# Altium schematic sheet PowerSupply.SchDoc: Power Supply Unit
size A; SheetNumber: 3; SheetTotal: 7
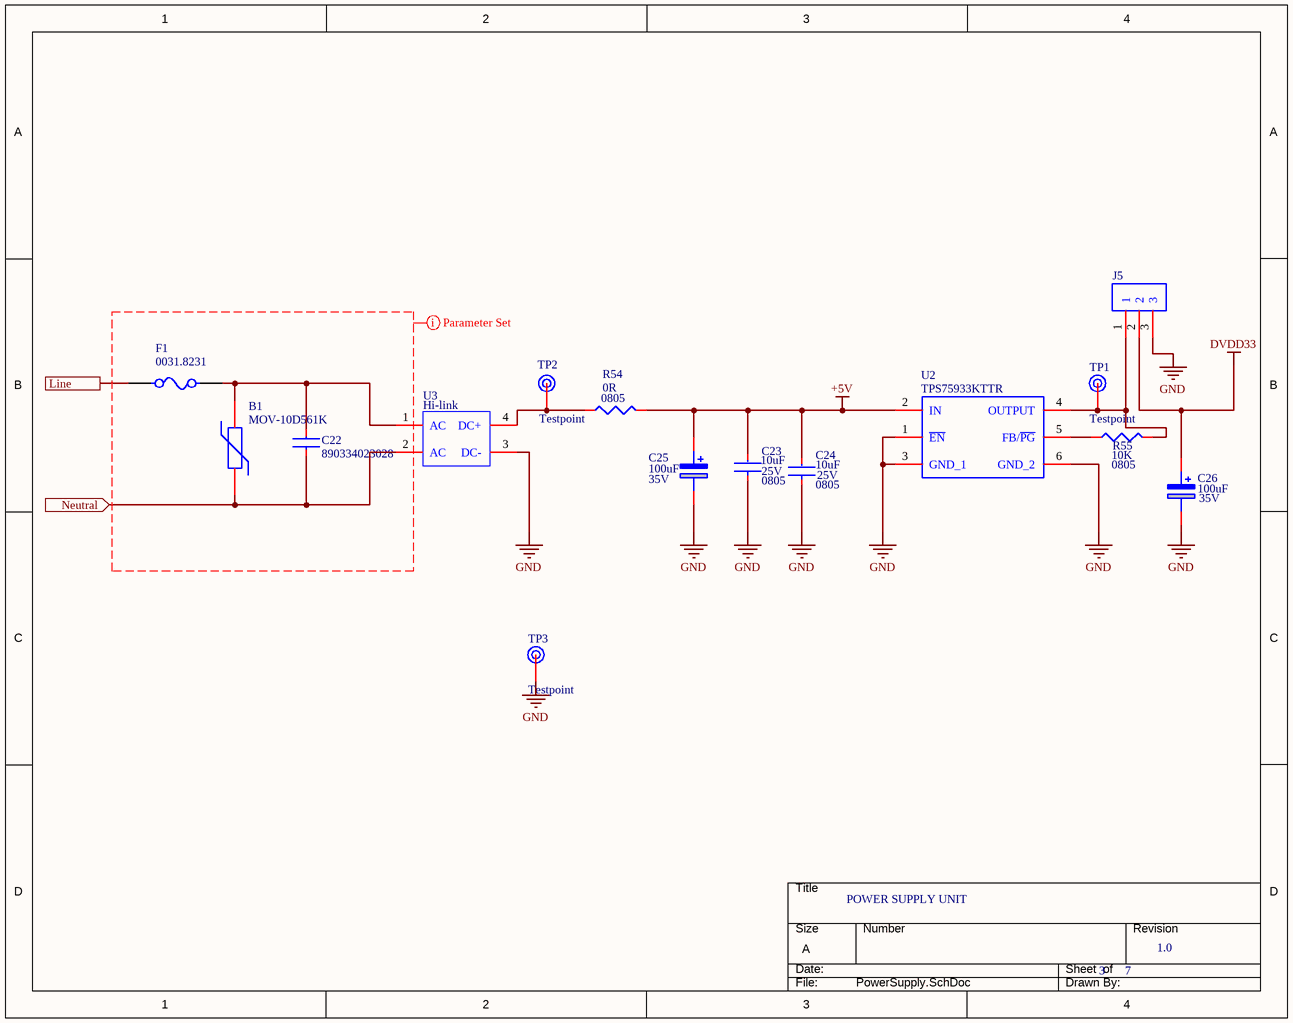
[diagram p0: PowerSupply.SchDoc]

## Parts
B1  MOV-10D561K  [MOV10D561K]
C22  890334023028  [890334023028]
C23  Capacitance: 10uF  Voltage: 25V  Size: 0805  [FP-GRM21B-0_2-e0_2_0_7-IPC_B]  (hidden comment: GRM21BC71E106KE01L)
C24  Capacitance: 10uF  Voltage: 25V  Size: 0805  [FP-GRM21B-0_2-e0_2_0_7-IPC_B]  (hidden comment: GRM21BC71E106KE01L)
C25  Capacitance: 100uF  Voltage: 35V  [CAPPRD250W50D630H1250]  (hidden comment: ESC107M035AE3AA)
C26  Capacitance: 100uF  Voltage: 35V  [CAPPRD250W50D630H1250]  (hidden comment: ESC107M035AE3AA)
F1  0031.8231  [FP-0031_8231-MFG]
J5  HTSW-103-07-G-S  [HDRV3W64P0X254_1X3_749X249X858P]  (value not drawn)
R54  Resistance: 0R  Size: 0805  [RESC2013X84N]  (hidden comment: WSL080500000ZEA9)
R55  Resistance: 10K  Size: 0805  [RESC2013X84N]  (hidden comment: CRCW201010K0JNEFIF)
TP1  Testpoint  [Testpad]
TP2  Testpoint  [Testpad]
TP3  Testpoint  [Testpad]
U2  TPS75933KTTR  [TPS75933KTTR]
U3  Hi-link  [Hi-Link]

## Ports
Line (see Main[3C], VoltageIn[4E], VoltageSensorInput[7E]), Neutral (in, see Main[3C], VoltageIn[4D])

## Nets
+5V: C23.2 C24.2 C25.1(+) R54.1 U2.2(IN)
DVDD33: C26.1(+) J5.2
GND: C23.1 C24.1 C25.2(-) C26.2(-) J5.3 TP3.1 U2.1(~{EN}) U2.3(GND_1) U2.6(GND_2) U3.3(DC-)
Line: F1.1 ; port Line
Neutral: B1.1 C22.1 U3.2(AC) ; port Neutral
NetB1_2: B1.2 C22.2 F1.2 U3.1(AC)
NetJ5_1: J5.1 R55.1 TP1.1 U2.4(OUTPUT)
NetR54_2: R54.2 TP2.1 U3.4(DC+)
NetR55_2: R55.2 U2.5(FB/~{PG})

## Layout directives
net class AC_Nets: (no net found under the mark)

## Notes on the sheet
- POWER SUPPLY UNIT
- 3
- 7
- 1.0

## Library data of the parts
B1 = MOV-10D561K: Varistors 180pF 560volts 10%; Manufacturer_Name: Bourns; Geometry.Height: 15.5mm; Mouser Part Number: 652-MOV-10D561K; Mouser Price/Stock: https://www.mouser.co.uk/ProductDetail/Bourns/MOV-10D561K?qs=lgttKnAd%252B2ArrqGQgWwr6w%3D%3D; Manufacturer_Part_Number: MOV-10D561K; Datasheet Link: https://www.bourns.com/docs/Product-Datasheets/MOV10D.pdf
C22 = 890334023028: WURTH ELEKTRONIK - 890334023028 - Safety Capacitor, 0.22 F, X2, WCAP-FTXX Series, 310 V, Metallized PP; Geometry.Height: 14.5mm; Mouser Part Number: 710-890334023028; Mouser Price/Stock: https://www.mouser.co.uk/ProductDetail/Wurth-Elektronik/890334023028?qs=pceeu5JH%2FH%2FQtsmowFDNJg%3D%3D; Manufacturer_Name: Wurth Elektronik; Manufacturer_Part_Number: 890334023028; Datasheet Link: *
C23 C24 = CMP-06035-063441-1: Chip Multilayer Ceramic Capacitors for General Purpose, 10μF ±10%, X7S(EIA), ±22.0%, 25Vdc, 0805 (2012M)
C25 C26 = ESC107M035AE3AA: ESC, Aluminum, Aluminum Electrolytic, 100 uF, 20%, 35 VDC, -40/+105C, 105C, -40C, 105C, 2,000 Hrs, 12 % , 180 mOhms, 35 uA, 3, 4, 6.3mm, 11mm, Lead Spacing = 2.5mm, 20mm, 10000; Manufacturer_Name: KEMET; Geometry.Height: 12.5mm; Mouser Part Number: 80-ESC107M035AE3AA; Mouser Price/Stock: https://www.mouser.co.uk/ProductDetail/KEMET/ESC107M035AE3AA?qs=F5EMLAvA7IA7q%2FLtm4zOMg%3D%3D; Manufacturer_Part_Number: ESC107M035AE3AA; Datasheet Link: https://content.kemet.com/datasheets/KEM_A4006_ESC.pdf
F1 = CMP-26292-000005-1: FUSE BLOK CARTRIDGE 600V 16A PCB; Manufacturer: Schurter; Voltage Rating Ac: 500V; Number Of Fuses: 1; Standoff Height: 0.7mm; Conn Orientation: Horizontal; ComponentLink2URL: https://www.schurter.com/en/datasheet/typ_OGD.pdf; Voltage Rating Dc: 600V; Package: 0; Device Class L3: unset; Digikey Description: FUSE BLOK CARTRIDGE 600V 16A PCB; Mouser Description: Fuse Holder OGD FUSEHOLDER 5X20/6.3X32; Category: Fuse; Device Class L2: Fuse Holders; Height: 12.7mm; ComponentLink2Description: Datasheet; Ambient Temperature Range Low: -40°C; Ambient Temperature Range High: +85°C; Octopart: https://octopart.com/0031.8231-schurter-8659; Automotive: No; RoHS: TRUE; Fuse Current: 16A; Lead Free: Yes; Device Class L1: Circuit Protection; Manufacturer Part Number: 0031.8231
J5 = HTSW-103-07-G-S: Samtec HTSW, 2.54mm Pitch, 3 Way, 1 Row, Vertical Pin Header, Through Hole; Geometry.Height: 8.58mm; Mouser Part Number: 200-HTSW10307GS; Mouser Price/Stock: https://www.mouser.co.uk/ProductDetail/Samtec/HTSW-103-07-G-S?qs=0lQeLiL1qyYZ%252B%2F6nDbu9tg%3D%3D; Manufacturer_Name: SAMTEC; Manufacturer_Part_Number: HTSW-103-07-G-S; Datasheet Link: http://suddendocs.samtec.com/prints/htsw-xxx-xx-xxx-x-xx-xx-xx-mkt.pdf
R54 = WSL080500000ZEA9: VISHAY - WSL080500000ZEA9 - SMD Chip Resistor, Jumper, 0805 [2012 Metric], 0 ohm, WSL-9 Series, Metal Strip; Geometry.Height: 0.838mm; Mouser Part Number: 71-WSL080500000ZEA9; Mouser Price/Stock: https://www.mouser.co.uk/ProductDetail/Vishay-Dale/WSL080500000ZEA9?qs=f1l5vAGoKgsImKS87N8TmQ%3D%3D; Manufacturer_Name: Vishay; Manufacturer_Part_Number: WSL080500000ZEA9; Datasheet Link: https://ad.componentsearchengine.com/Datasheets/2/WSL080500000ZEA9.pdf
R55 = WSL080500000ZEA9: VISHAY - CRCW201010K0JNEFIF - SMD Chip Resistor, Jumper, 0805 [2012 Metric], 10k, WSL-9 Series, Metal Strip; Geometry.Height: 0.838mm; Mouser Part Number: 71-WSL080500000ZEA9; Mouser Price/Stock: https://www.mouser.co.uk/ProductDetail/Vishay-Dale/WSL080500000ZEA9?qs=f1l5vAGoKgsImKS87N8TmQ%3D%3D; Manufacturer_Name: Vishay; Manufacturer_Part_Number: WSL080500000ZEA9; Datasheet Link: https://ad.componentsearchengine.com/Datasheets/2/WSL080500000ZEA9.pdf
U2 = TPS75933KTTR: Fast-Transient Response, 7.5-A, Low-Dropout Voltage Regulators with Power Good; Manufacturer_Name: Texas Instruments; Geometry.Height: 4.83mm; Mouser Part Number: 595-TPS75933KTTR; Mouser Price/Stock: https://www.mouser.co.uk/ProductDetail/Texas-Instruments/TPS75933KTTR?qs=6zVL%252ByCp0mrrB34Pfenz6g%3D%3D; Manufacturer_Part_Number: TPS75933KTTR; Datasheet Link: http://www.ti.com/lit/gpn/tps759
U3 = Hi-link: Hi-Link HLK-20M05 220VAC to 5VDC 20W Step-Down Power Supply Module